# EAGLE design bristol_longshot (EAGLE 7.3.0)
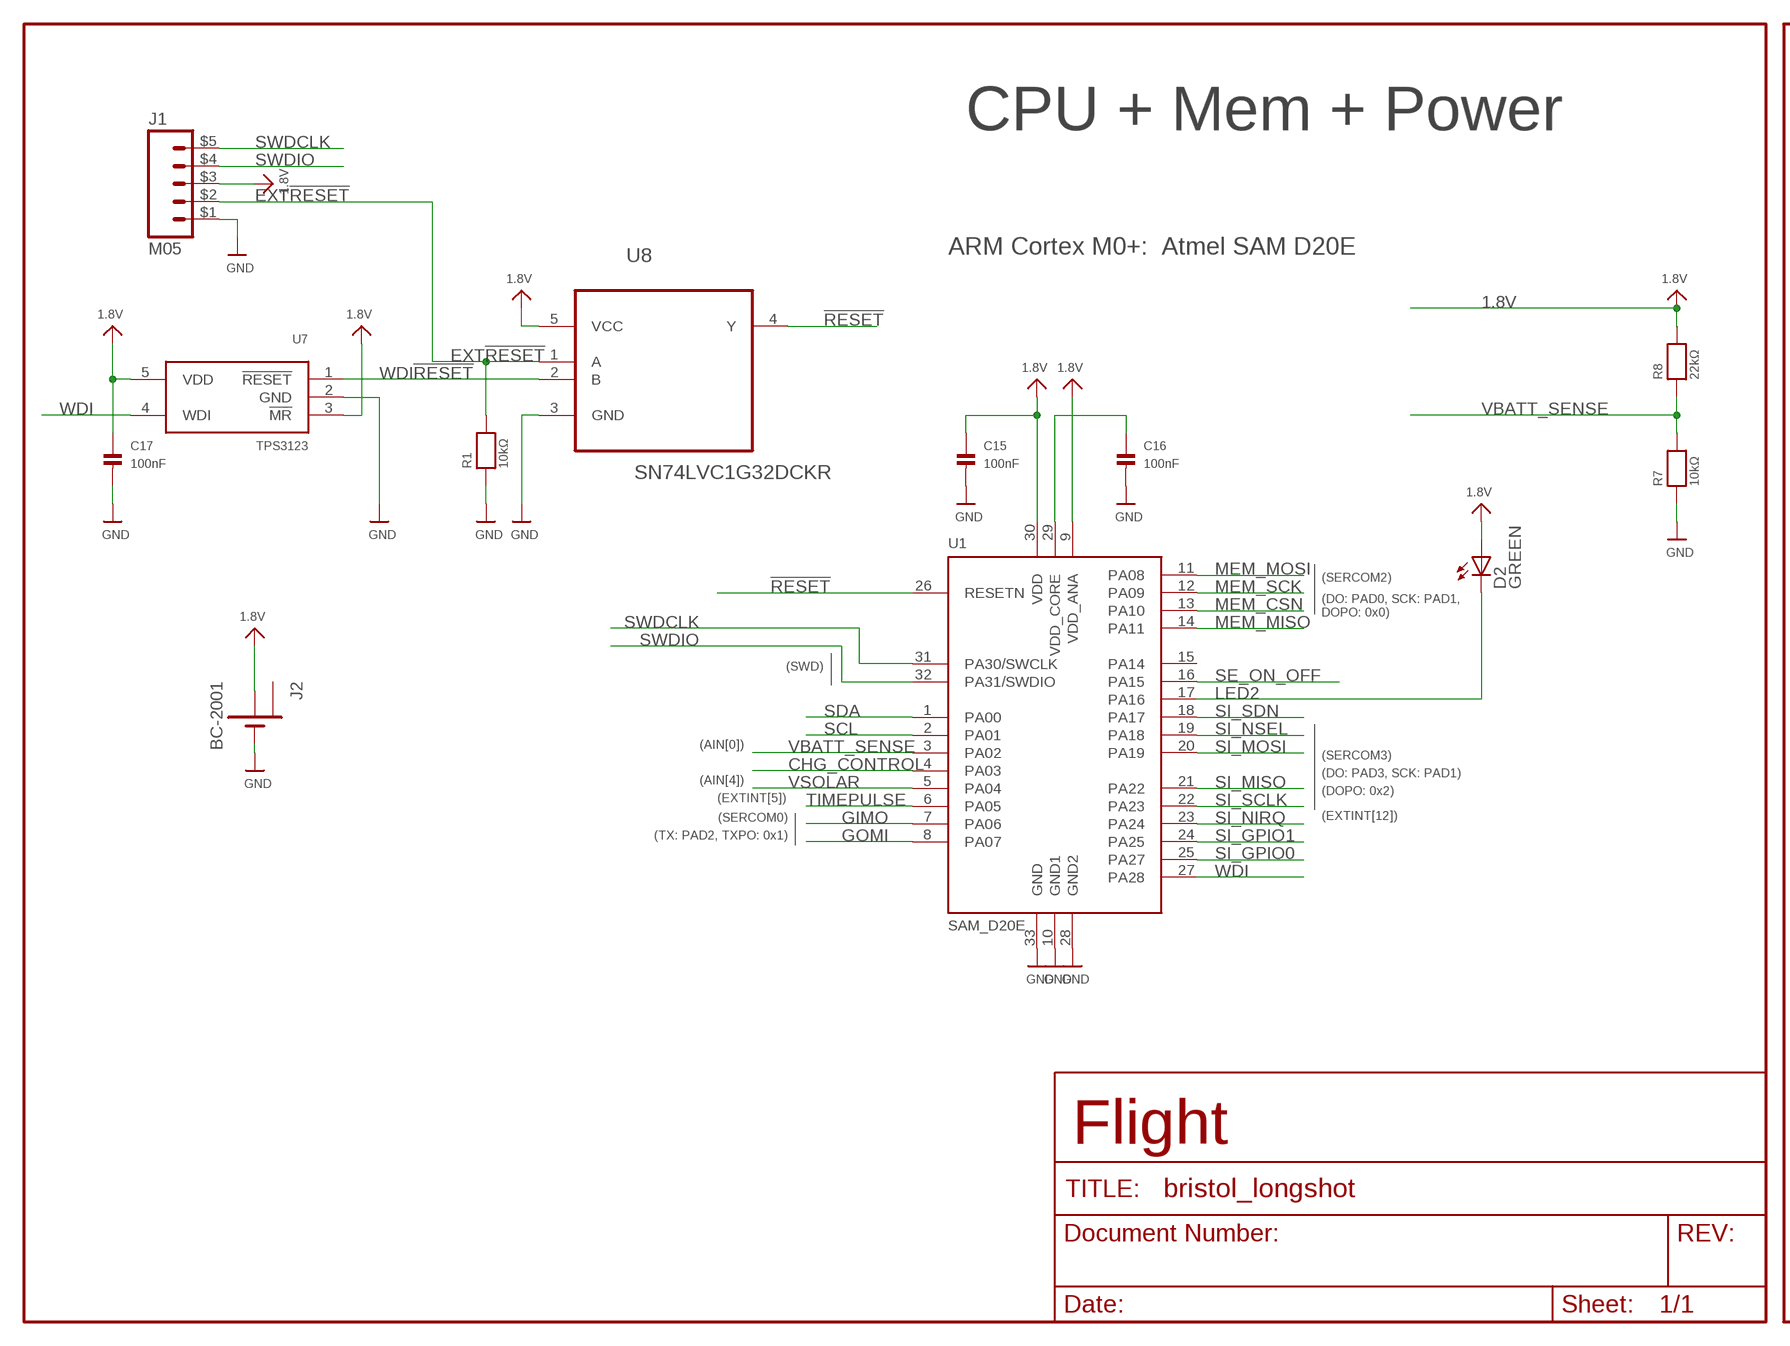
[diagram p0: schematic, sheet 1, part 1 of 2]
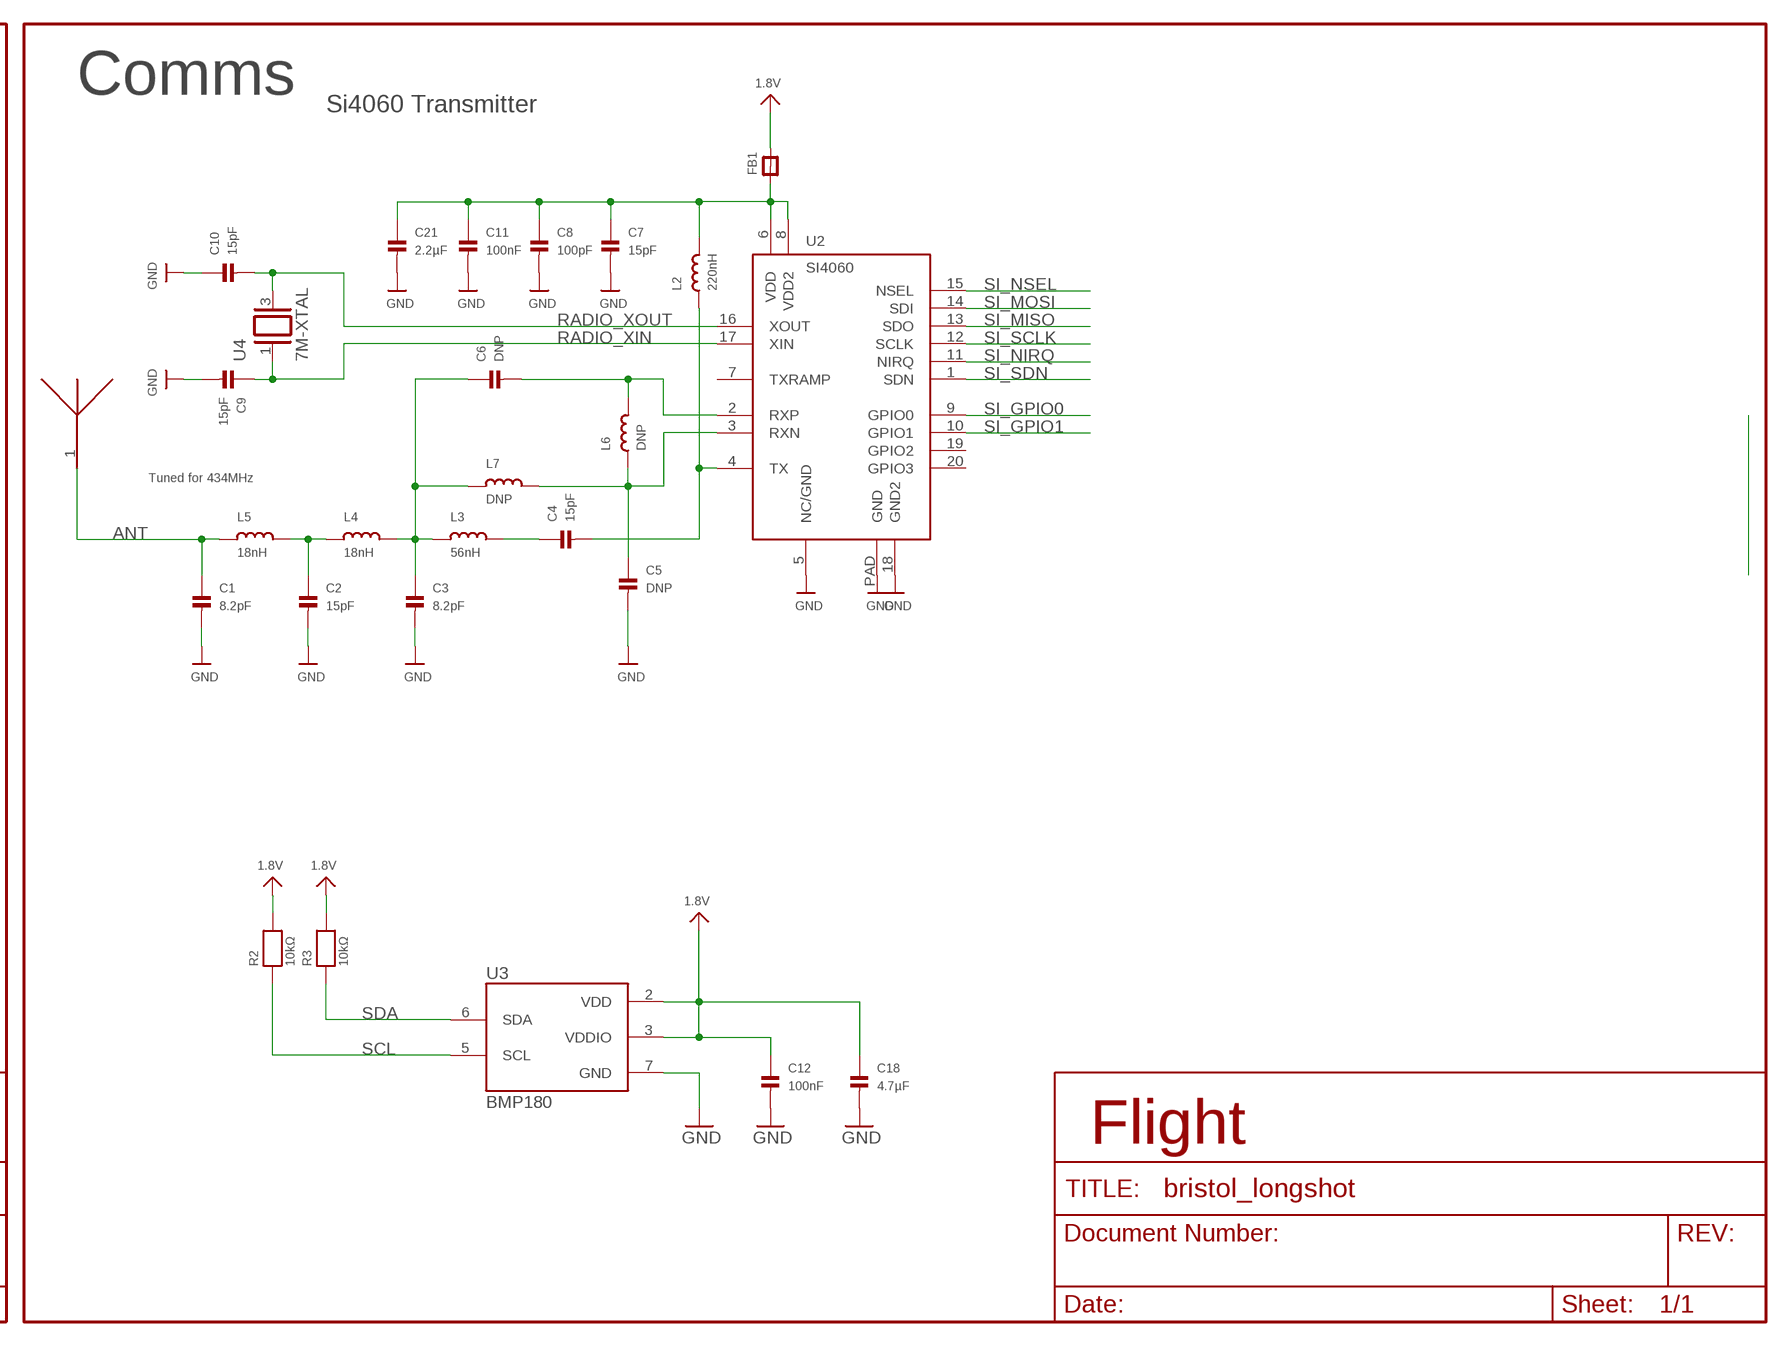
[diagram p1: schematic, sheet 1, part 2 of 2]

## Parts
C1  8.2pF  CAP_CERAMIC_0402  [_0402]
C2  15pF  CAP_CERAMIC_0402  [_0402]
C3  8.2pF  CAP_CERAMIC_0402  [_0402]
C4  15pF  CAP_CERAMIC_0402  [_0402]
C5  DNP  CAP_CERAMIC_0402  [_0402]
C6  DNP  CAP_CERAMIC_0402  [_0402]
C7  15pF  CAP_CERAMIC_0402  [_0402]
C8  100pF  CAP_CERAMIC_0402  [_0402]
C9  15pF  CAP_CERAMIC_0402  [_0402]
C10  15pF  CAP_CERAMIC_0402  [_0402]
C11  100nF  CAP_CERAMIC_0402  [_0402]
C12  100nF  CAP_CERAMIC_0402  [_0402]
C15  100nF  CAP_CERAMIC_0402  [_0402]
C16  100nF  CAP_CERAMIC_0402  [_0402]
C17  100nF  CAP_CERAMIC_0402  [_0402]
C18  4.7µF  CAP_CERAMIC_0402  [_0402]
C21  2.2µF  CAP_CERAMIC_0402  [_0402]
D2  GREEN  LEDCHIPLED_0603  [CHIPLED_0603]
FB1  FERRITE_0402  [_0402]
J1  M05  [M05_SIDE]
J2  BC-2001  [BC-2001]
L2  220nH  INDUCTOR_0402  [_0402]
L3  56nH  INDUCTOR_0402  [_0402]
L4  18nH  INDUCTOR_0402  [_0402]
L5  18nH  INDUCTOR_0402  [_0402]
L6  DNP  INDUCTOR_0402  [_0402]
L7  DNP  INDUCTOR_0402  [_0402]
R1  10kΩ  RESISTOR_0402  [_0402]
R2  10kΩ  RESISTOR_0402  [_0402]
R3  10kΩ  RESISTOR_0402  [_0402]
R7  10kΩ  RESISTOR_0402  [_0402]
R8  22kΩ  RESISTOR_0402  [_0402]
U1  SAM_D20E  [QFN32_5MM]
U2  SI4060  [QFN20]
U3  BMP180  [BMP180]
U4  7M-XTAL  [7M-XTAL]
U5  0433AT62A0020E  [0433AT62A0020E]
U7  TPS3123  [SOT23-5]
U8  SN74LVC1G32DCKR  [SOT65P210X110-5N]

## Nets
1.8V: C12.1 C15.1 C17.1 C18.1 D2.A FB1.2 J1.$3 J2.+VE1(+) R2.2 R3.2 R8.2 U1.9(VDD_ANA) U1.30(VDD) U3.2(VDD) U3.3(VDDIO) U7.3(!MR) U7.5(VDD) U8.5(VCC)
!RESET: U1.26(RESETN) U8.4(Y)
ANT: C1.1 L5.1 U5.1
CHG_CONTROL: U1.4(PA03)
EXT!RESET: J1.$2 R1.2 U8.1(A)
FILTER1: C3.1 C6.1 L3.1 L4.2 L7.1
FILTER2: C2.1 L4.1 L5.2
GIMO: U1.7(PA06)
GND: C1.2 C2.2 C3.2 C5.2 C7.2 C8.2 C9.2 C10.1 C11.2 C12.2 C15.2 C16.2 C17.2 C18.2 C21.2 J1.$1 J2.-VE(-) R1.1 R7.1 U1.10(GND1) U1.28(GND2) U1.33(GND) U2.5(NC/GND) U2.18(GND2) U2.PAD(GND) U3.7(GND) U7.2(GND) U8.3(GND)
GOMI: U1.8(PA07)
LED2: D2.C U1.17(PA16)
MEM_CSN: U1.13(PA10)
MEM_MISO: U1.14(PA11)
MEM_MOSI: U1.11(PA08)
MEM_SCK: U1.12(PA09)
RADIO_VDD: C7.1 C8.1 C11.1 C21.1 FB1.1 L2.2 U2.6(VDD) U2.8(VDD2)
RADIO_XIN: C9.1 U2.17(XIN) U4.1
RADIO_XOUT: C10.2 U2.16(XOUT) U4.3
RF_OUT: C4.2 L2.1 U2.4(TX)
RF_TANK: C4.1 L3.2
RXN: C5.1 L6.1 L7.2 U2.3(RXN)
RXP: C6.2 L6.2 U2.2(RXP)
SCL: R2.1 U1.2(PA01) U3.5(SCL)
SDA: R3.1 U1.1(PA00) U3.6(SDA)
SE_ON_OFF: U1.16(PA15)
SI_GPIO0: U1.25(PA27) U2.9(GPIO0)
SI_GPIO1: U1.24(PA25) U2.10(GPIO1)
SI_MISO: U1.21(PA22) U2.13(SDO)
SI_MOSI: U1.20(PA19) U2.14(SDI)
SI_NIRQ: U1.23(PA24) U2.11(NIRQ)
SI_NSEL: U1.19(PA18) U2.15(NSEL)
SI_SCLK: U1.22(PA23) U2.12(SCLK)
SI_SDN: U1.18(PA17) U2.1(SDN)
SWDCLK: J1.$5 U1.31(PA30/SWCLK)
SWDIO: J1.$4 U1.32(PA31/SWDIO)
TIMEPULSE: U1.6(PA05)
VBATT_SENSE: R7.2 R8.1 U1.3(PA02)
VDD_CORE: C16.1 U1.29(VDD_CORE)
VSOLAR: U1.5(PA04)
WDI: U1.27(PA28) U7.4(WDI)
WDI!RESET: U7.1(!RESET) U8.2(B)
Unconnected: U1.15(PA14) U2.7(TXRAMP) U2.19(GPIO2) U2.20(GPIO3)

## Notes on the sheet
- Comms
- Si4060 Transmitter
- CPU + Mem + Power
- ARM Cortex M0+:  Atmel SAM D20E
- Tuned for 434MHz
- (SERCOM2)
- (DO: PAD0, SCK: PAD1,
  DOPO: 0x0)
- (SWD)
- (AIN[0])
- (SERCOM3)
- (DO: PAD3, SCK: PAD1)
- (AIN[4])
- (DOPO: 0x2)
- (EXTINT[5])
- (SERCOM0) | (EXTINT[12])
- (TX: PAD2, TXPO: 0x1)
- Flight | Flight

## Power pins joined to a net without a drawn wire
+2: J2.+VE2(+2)

## Library data of the parts
C1-C12 C15-C18 C21 = microbuilder_v3:CAP_CERAMIC: Ceramic Capacitors 0402 - 0402 Surface Mount Capacitors 16pF 50V 5% [Digikey: 445-4899-2-ND] 18pF 50V 5% [Digikey: 490-1281-2-ND] 22pF 50V 5% [Digikey: 490-1283-2-ND] 68pF 50V 5% [Digikey: 490-1289-2-ND] 0.1uF 10V 10% [Digikey: 490-1318-2-ND] 1.0uF 6.3V 10% [Digikey: 490-1320-2-ND] 0603 - 0603 Surface Mount Capacitors 16 pF 50V 5% [Digikey: 445-5051-2-ND] 22 pF 50V [Digikey: PCC220ACVTR-ND] 33 pF 50V 5% [Digikey: 490-1415-1-ND] 56pF 50V 5% [Digikey: 490-1421-1-ND] 220pF 50V 5% [Digikey: 445-1285-1-ND] 680 pF 50V 2200 pF 50V 5% C0G [Digikey: 445-1297-1-ND] 5600 pF 100V 5% X7R [Digikey: 478-3711-1-ND] 0.1 µF 25V 10% [Digikey: PCC2277TR-ND] 0.22 µF 16V 10% X7R [Digikey: 445-1318-1-ND] 1.0 µF 25V 10% [Digikey: 445-5146-2-ND] 0603 - RF Specific 3pF 250V +/-0.1pF RF [Digikey: 712-1347-1-ND] 18 pF 250V 5% [Digikey: 478-3505-1-ND or 712-1322-1-ND] 56 pF 250V 5% C0G RF [Digikey: 490-4867-1-ND] 68 pF 250V RF [Digikey: 490-4868-1-ND] 0805 - 0805 Surface Mount Capacitors 220 pF 250V 2% RF Ceramic Capacitor [Digikey: 712-1398-1-ND] 1000 pF 50V 2% NP0 Ceramic Capacitor [Digikey: 478-3760-1-ND] 0.1 µF 25V 10% Ceramic Capacitor [Digikey: PCC1828TR-ND] 1.0 µF 16V 10% Ceramic Capacitor[Digikey: 490-1691-2-ND] 10.0 µF 10V 10% Ceramic Capacitor[Digikey: 709-1228-1-ND] 10.0 uF 16V 10% Ceramic Capacitor [Digikey: 478-5165-2-ND] 47 uF 6.3V 20% Ceramic Capacitor [Digikey: 587-1779-1-ND or 399-5506-1-ND] 1206 - 1206 Surface Mount Capacitors 47uF 10V 20% Ceramic Capacitor [Digikey: 490-5528-1-ND or 399-5508-1-ND or 445-6010-1-ND] 100uF 6.3V -20%, +80% Y5V Ceramic Capacitor (Digikey: 490-4512-1-ND, Mouser: 81-GRM31CF50J107ZE1L)
D2 = led:LED: LED OSRAM: - CHIPLED LG R971, LG N971, LY N971, LG Q971, LY Q971, LO R971, LY R971 LH N974, LH R974 LS Q976, LO Q976, LY Q976 LO Q996 - Hyper CHIPLED LW Q18S LB Q993, LB Q99A, LB R99A - SideLED LS A670, LO A670, LY A670, LG A670, LP A670 LB A673, LV A673, LT A673, LW A673 LH A674 LY A675 LS A676, LA A676, LO A676, LY A676, LW A676 LS A679, LY A679, LG A679 - Hyper Micro SIDELED® LS Y876, LA Y876, LO Y876, LY Y876 LT Y87S - SmartLED LW L88C, LW L88S LB L89C, LB L89S, LG L890 LS L89K, LO L89K, LY L89K LS L896, LA L896, LO L896, LY L896 - TOPLED LS T670, LO T670, LY T670, LG T670, LP T670 LSG T670, LSP T670, LSY T670, LOP T670, LYG T670 LG T671, LOG T671, LSG T671 LB T673, LV T673, LT T673, LW T673 LH T674 LS T676, LA T676, LO T676, LY T676, LB T676, LH T676, LSB T676, LW T676 LB T67C, LV T67C, LT T67C, LS T67K, LO T67K, LY T67K, LW E67C LS E67B, LA E67B, LO E67B, LY E67B, LB E67C, LV E67C, LT E67C LW T67C LS T679, LY T679, LG T679 LS T770, LO T770, LY T770, LG T770, LP T770 LB T773, LV T773, LT T773, LW T773 LH T774 LS E675, LA E675, LY E675, LS T675 LS T776, LA T776, LO T776, LY T776, LB T776 LHGB T686 LT T68C, LB T68C - Hyper Mini TOPLED® LB M676 - Mini TOPLED Santana® LG M470 LS M47K, LO M47K, LY M47K Source: http://www.osram.convergy.de LUXEON: - LUMILED® LXK2-PW12-R00, LXK2-PW12-S00, LXK2-PW14-U00, LXK2-PW14-V00 LXK2-PM12-R00, LXK2-PM12-S00, LXK2-PM14-U00 LXK2-PE12-Q00, LXK2-PE12-R00, LXK2-PE12-S00, LXK2-PE14-T00, LXK2-PE14-U00 LXK2-PB12-K00, LXK2-PB12-L00, LXK2-PB12-M00, LXK2-PB14-N00, LXK2-PB14-P00, LXK2-PB14-Q00 LXK2-PR12-L00, LXK2-PR12-M00, LXK2-PR14-Q00, LXK2-PR14-R00 LXK2-PD12-Q00, LXK2-PD12-R00, LXK2-PD12-S00 LXK2-PH12-R00, LXK2-PH12-S00 LXK2-PL12-P00, LXK2-PL12-Q00, LXK2-PL12-R00 Source: www.luxeon.com KINGBRIGHT: KA-3528ASYC Source: www.kingbright.com
FB1 = microbuilder_v3:FERRITE: Ferrite Bead 0603 MMZ1608B121C - 120 Ohm @ 100MHz, 600mA, 0.15 Ohm DC Resistance - Digikey: 445-2164-1-ND BK1608HW121-T - 120 Ohm, 600mA Ferrite Chip - Digikey: 587-1876-2-ND 0805 HZ0805B272R-10 - 2.7K Ohm @ 100MHz, 200mA, 0.8 Ohm DC Resistance - Digikey: 240-2504-1-ND (see also Murata BLM21BD272SN1L) MMZ2012Y152B - 1.5K Ohm @ 100MHz, 500mA, 0.4 Ohm DC Resistance - Digikey: 445-1560-1-ND - Mainly for high frequency (80-400MHz) MMZ2012R102A - 1K Ohm @ 100MHz, 500mA, 0.3 Ohm DC Resistance - Digikey: 445-1555-2-ND - More general purpose (10-200MHz)
J1 = fbri:M05
J2 = fbri:BC-2001
L2-L7 = microbuilder_v3:INDUCTOR: Inductors 0603: 10nH Ceramic Inductor - microwire antenna/RF (Digikey: 712-1434-2-ND) 0805: 560nH Ceramic Inductor - RF (Digikey: 553-1047-1-ND) 270nH Ceramic Inductor - Q = 40@250MHz, +-5%, 1 Ohm DC Resistance (Digikey: 535-10506-2-ND) 1007 (2518 Metric) SMT: 10µH 10% 250mOhm 820mA 1007 Inductor (Digikey: 587-2189-1-ND) 22µH 10% 500mOhm 580mA 1007 Inductor (Digikey: 587-2190-1-ND) 47µH 10% 950mOhm 420mA 1007 Inductor (Digikey: 587-2191-1-ND) 47µH 5% 100mOhm 1A 1008 Inductor (Digikey: 732-1816-1-ND) 5.0x5.0mm (Taiyo Yuden NR5040 Series) 6.8µH 20% 2.3A 64mOhm Inductor (Digikey: 587-2374-2-ND) 5.0x5.0mm (TDK VLC5045 Series) 4.7µH 20% 3.3A 34mOhm Inductor (Digikey: 445-6526-1-ND) 6.8µH 20% 2.7A 46mOhm Inductor (Digikey: 445-6527-1-ND) 6.0x6.0mm (TDK VLC6045 Series) 4.7µH 20% 3.8A 27mOhm Inductor (Digikey: 445-6538-2-ND) 6.8µH 20% 3A 41mOhm Inductor (Digikey: 445-6540-1-ND) 6.2µH 30% 2.2A 45mOhm Inductor (Digikey: SRR5028-6R2YCT-ND) - Not TDK VLC6045 but footprint should match 6.0x6.0mm (TDK SLF6045 Series) 6.8uH 30% 2A 33mOhm Inductor (Digikey: 445-4572-1-ND, Mouser: 810-SLF645T6R8N2R0PF)
R1-R3 R7 R8 = microbuilder_v3:RESISTOR: Resistors 0402 - 0402 Surface Mount Package 22 Ohm 1% 1/16W [Digikey: 311-22.0LRTR-ND] 33 Ohm 5% 1/16W 1.0K 5% 1/16W 1.5K 5% 1/16W 2.0K 1% 1/16W 10.0K 1% 1/16W [Digikey: 311-10.0KLRTR-ND] 10.0K 5% 1/16W [Digikey: RMCF0402JT10K0TR-ND] 12.1K 1% 1/16W [Digikey: 311-22.0LRTR-ND] 100.0K 5% 1/16W 0603 - 0603 Surface Mount Package 0 Ohm 1/10 Watt 1% Resistor 15 Ohm 1/10 Watt 1% Resistor 33 Ohm 1/10 Watt 1% Resistor 49.9 Ohm 1/10 Watt 1% Resistor 100 Ohm 1/10 Watt 1% Resistor 150 Ohm 1/10 Watt 1% Resistor 240 Ohm 1/10 Watt 1% Resistor 390 Ohm 1/10 Watt 1% Resistor 560 Ohm 1/10 Watt 1% Resistor 680 Ohm 1/10 Watt 1% Resistor 750 Ohm 1/10 Watt 1% Resistor 1.0K Ohm 1/10 Watt 1% Resistor 1.5K Ohm 1/10 Watt 1% Resistor 2.0K Ohm 1/10 Watt 1% Resistor 2.2K Ohm 1/10 Watt 1% Resistor 3.3K Ohm 1/10 Watt 1% Resistor 4.7K Ohm 1/10 Watt 1% Resistor 10.0K Ohm 1/10 Watt 1% Resistor 12.0K Ohm 1/10 Watt 1% Resistor 12.1K Ohm 1/10 Watt 1% Resistor 20.0K Ohm 1/10 Watt 1% Resistor 33.0K Ohm 1/10 Watt 1% Resistor 100.0K Ohm 1/10 Watt 1% Resistor 0805 - 0805 Surface Mount Package 0 Ohm 1/8 Watt 1% Resistor 33 Ohm 1/8 Watt 1% Resistor 100 Ohm 1/8 Watt 1% Resistor 150 Ohm 1/8 Watt 1% Resistor 200 Ohm 1/8 Watt 1% Resistor 240 Ohm 1/8 Watt 1% Resistor 330 Ohm 1/8 Watt 1% Resistor 390 Ohm 1/8 Watt 1% Resistor 470 Ohm 1/8 Watt 1% Resistor 1.0K Ohm 1/8 Watt 1% Resistor 1.5K Ohm 1/8 Watt 1% Resistor 2.0K Ohm 1/8 Watt 1% Resistor 4.7K Ohm 1/8 Watt 1% Resistor 5.1K Ohm 1/8 Watt 1% Resistor 5.6K Ohm 1/8 Watt 1% Resistor 10.0K Ohm 1/8 Watt 1% Resistor 22.0K Ohm 1/8 Watt 1% Resistor 33.0K Ohm 1/8 Watt 1% Resistor 100K Ohm 1/8 Watt 1% Resistor 1206 - 1206 Surface Mount Package 2012 - 2010 Surface Mount Package 0.11 Ohm 1/2 Watt 1% Resistor - Digikey: RHM.11UCT-ND
U1 = fbri:SAM_D20E
U2 = fbri:SI4060
U3 = SparkFun-Sensors:BMP180: BOSCH BMP180 DIGITAL BAROMETRIC PRESSURE SENSOR Web page: http://www.bosch-sensortec.com/en/homepage/products_3/environmental_sensors_1/bmp180_1/bmp180 Datasheet: http://ae-bst.resource.bosch.com/media/products/dokumente/bmp180/BST-BMP180-DS000-09.pdf The BMP180 is the function compatible successor of the BMP085, a new generation of high precision digital pressure sensors for consumer applications. The ultra-low power, low voltage electronics of the BMP180 is optimized for use in mobile phones, PDAs, GPS navigation devices and outdoor equipment. With a low altitude noise of merely 0.25m at fast conversion time, the BMP180 offers superior performance. The I2C interface allows for easy system integration with a microcontroller. The BMP180 is based on piezo-resistive technology for EMC robustness, high accuracy and linearity as well as long term stability. Key features: - Temperature measurement included - I2C interface - Fully calibrated - Pb-free, halogen-free and RoHS compliant, - MSL 1 Basic specs: Pressure range: 300 to 1100hPa (+9000m to -500m relating to sea level) Supply voltage: 1.8 to 3.6V (VDD), 1.62V to 3.6V (VDDIO) Package: LGA package with metal lid Small footprint: 3.6mm x 3.8mm Super-flat: 0.93mm height Low power: 5μA at 1 sample / sec. in standard mode Low noise: 0.06hPa (0.5m) in ultra low power mode, 0.02hPa (0.17m) advanced resolution mode Typical applications: - Enhancement of GPS navigation (dead-reckoning, slope detection, etc.) - In- and out-door navigation - Leisure and sports - Weather forecast - Vertical velocity indication (rise/sink speed)
U4 = fbri:7M-XTAL
U5 = fbri:0433AT62A0020E
U7 = TPS3125:TPS3123
U8 = SN74LVC1G32DCKR:SN74LVC1G32DCKR: 2-INPUT POSITIVE-OR GATE; MPN: SN74LVC1G32DCKR; OC_FARNELL: 1470880; OC_NEWARK: 76C4094; PACKAGE: SC-70-5; SUPPLIER: Texas Instruments

## Board
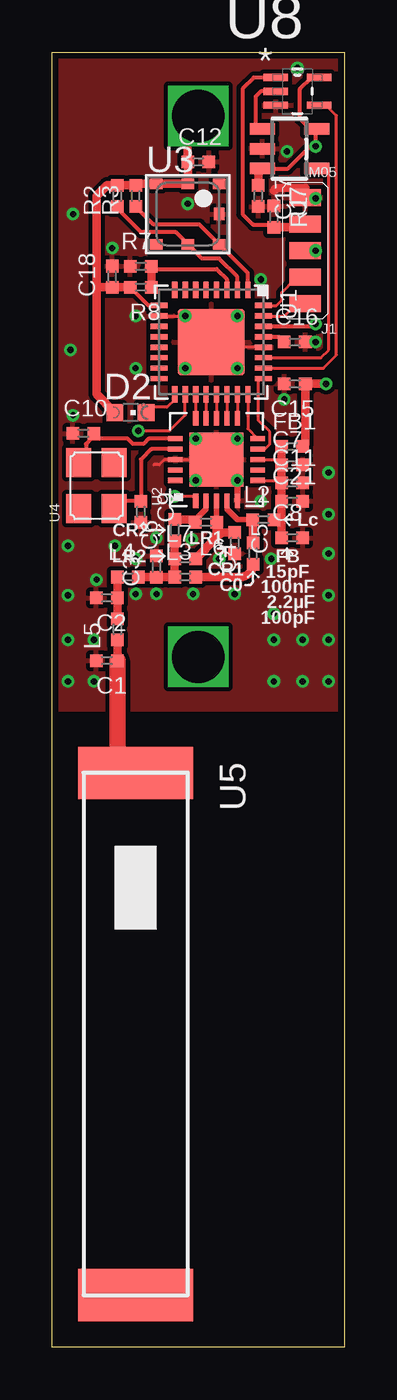
[diagram p2: board, top side]
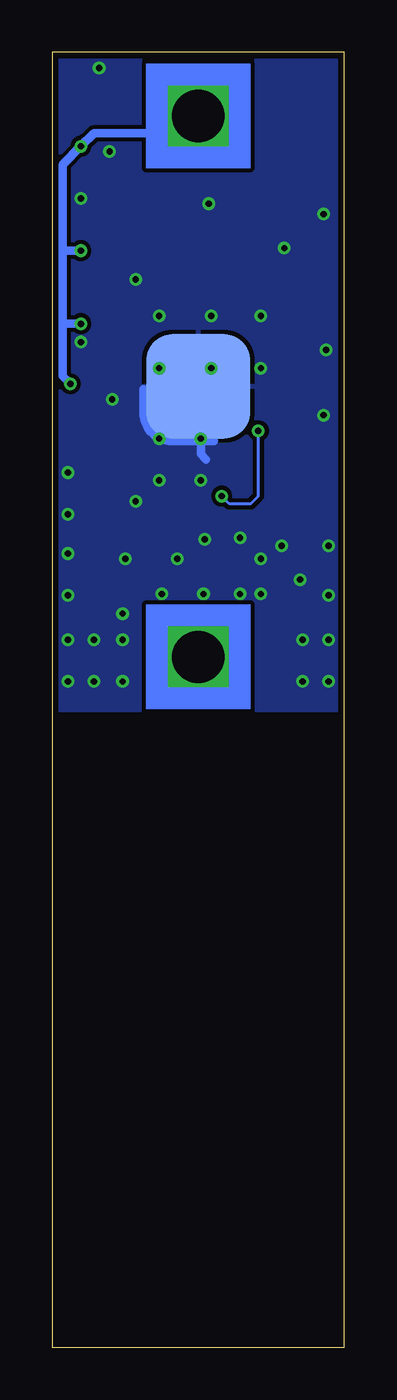
[diagram p3: board, bottom side, seen from below]

Size 14 x 62 mm. Coordinates in mm from the lower left corner, seen from the top.
Outline: 0,0 0,62 14,62 14,0 0,0
Copper layers (1*16): Top 0.035mm / dielectric 1.5mm / Bottom 0.035mm
Design rules "PCB-POOL Standard *": minimum track width 0.15mm, minimum drill 0.3mm, track to track 0.15mm, track to pad 0.15mm, pad to pad 0.15mm, via to via 0.15mm, smd to smd 0.15mm, copper to edge 0.3mm, drill to drill 0.2mm, minimum pad ring 0.2mm, minimum via ring 0.15mm, stop-mask expansion 0.075mm, vias tented up to drill 0.3mm, thermal gap 0.2mm
tRestrict: area 6.3,40.1 to 6.5,40.4

### Footprints (pad centres in the part's own frame; a part is rotated, then mirrored left to right if it is on the bottom)
_0402 = smd 0.6 x 0.6: 1 -0.508,0; 2 0.508,0
CHIPLED_0603 = smd 0.8 x 0.8: A 0,-0.75; C 0,0.75
M05_SIDE = smd 1.5 x 0.8: $1 0,-2.54; $2 0,-1.27; $3 0,0; $4 0,1.27; $5 0,2.54
BC-2001 = drill 2.5 square: +VE1 -12.95,0; +VE2 12.95,0 | smd 5 x 5: -VE 0,0
QFN32_5MM = smd 0.8 x 0.25: 1 -2.5,1.75; 2 -2.5,1.25; 3 -2.5,0.75; 4 -2.5,0.25; 5 -2.5,-0.25; 6 -2.5,-0.75; 7 -2.5,-1.25; 8 -2.5,-1.75; 17 2.5,-1.75; 18 2.5,-1.25; 19 2.5,-0.75; 20 2.5,-0.25; 21 2.5,0.25; 22 2.5,0.75; 23 2.5,1.25; 24 2.5,1.75 | smd 0.25 x 0.8: 9 -1.75,-2.5; 10 -1.25,-2.5; 11 -0.75,-2.5; 12 -0.25,-2.5; 13 0.25,-2.5; 14 0.75,-2.5; 15 1.25,-2.5; 16 1.75,-2.5; 25 1.75,2.5; 26 1.25,2.5; 27 0.75,2.5; 28 0.25,2.5; 29 -0.25,2.5; 30 -0.75,2.5; 31 -1.25,2.5; 32 -1.75,2.5 | smd 3.2 x 3.2: 33 0,0
QFN20 = smd 0.7 x 0.25: 1 -1.97,1; 2 -1.97,0.5; 3 -1.97,0; 4 -1.97,-0.5; 5 -1.97,-1; 11 1.97,-1; 12 1.97,-0.5; 13 1.97,0; 14 1.97,0.5; 15 1.97,1 | smd 0.25 x 0.7: 6 -1,-1.97; 7 -0.5,-1.97; 8 0,-1.97; 9 0.5,-1.97; 10 1,-1.97; 16 1,1.97; 17 0.5,1.97; 18 0,1.97; 19 -0.5,1.97; 20 -1,1.97 | smd 2.6 x 2.6: PAD 0,0
BMP180 = smd 0.6 x 0.5: 1 1.5,1.45; 2 0,1.45; 3 -1.5,1.45; 4 -1.5,-1.45; 5 0,-1.45; 6 1.5,-1.45 | smd 0.5 x 0.6: 7 1.5,0
7M-XTAL = smd 1.4 x 1.2: 1 -1.1,-0.85; 2 1.1,-0.85; 3 1.1,0.85; 4 -1.1,0.85
0433AT62A0020E = smd 5.5 x 2.5: 1 0,-12.5; 2 0,12.5
SOT23-5 = smd 0.55 x 1.2: 1 -0.95,-1.3; 2 0,-1.3; 3 0.95,-1.3; 4 0.95,1.3; 5 -0.95,1.3
SOT65P210X110-5N = smd 1.168 x 0.356: 1 -1.041,0.66; 2 -1.041,0; 3 -1.041,-0.66; 4 1.041,-0.66; 5 1.041,0.66

### Placement (x,y rotation side)
C1  2.62,32.88 180 top
C2  2.62,35.88 180 top
C3  5,37.38 90 top
C4  9.62,38 90 top
C5  8.75,38.5 270 top
C6  5.88,39.12 90 top
C7  11.5,42.25 0 top
C8  11.5,38.75 0 top
C9  4.25,40 270 top
C10  1.5,43.75 0 top
C11  11.5,41.38 0 top
C12  7,56.75 0 top
C15  11.62,46.12 180 top
C16  11.62,48.12 0 top
C17  9.88,55.12 270 top
C18  2.88,51.25 90 top
C21  11.5,40.5 0 top
D2  3.75,44.75 270 top
FB1  11.5,43.12 0 top
J1  12.12,52.5 180 top
J2  7,46 270 bottom
L2  10.12,39.62 0 top
L3  6.38,36.88 0 top
L4  3.62,36.88 0 top
L5  3.12,34.38 90 top
L6  7.38,39.5 180 top
L7  6.38,37.75 0 top
R1  10.62,54.12 270 top
R2  3.12,55.12 90 top
R3  4,55.12 90 top
R7  4.25,51.75 0 top
R8  4.25,50.75 180 top
U1  7.62,48.12 270 top
U2  7.88,42.5 90 top
U3  6.5,54.25 0 top
U4  2.12,41.25 90 top
U5  4,15 180 top
U7  11.38,57.38 270 top
U8  11.75,60.12 0 top

### Tracks (layer width: path | path; a pad name or v marks a point on that pad's centre or on a via)
1.8V  (via drill 0.3)
  Top 0.2: U1.30 12.5,48.88 v12.62,49 | U8.5 12.41,60.78 11.88,60.25 11.88,58.83 12.38,58.33 U7.5 12.62,58.27 v12.62,57.5 12.38,57.5 11.3,56.42 U7.3 | U1.9 4.62,49.88 R8.2
  Top 0.4: v13.12,46.12 C15.1 12.13,43.25 FB1.2 | U7.3 9.88,56.23 C17.1 | J2.+VE1 6.49,58.44 C12.1 U3.2 U3.3 4.07,55.7 R3.2 R2.2 2.63,55.63 2.12,55.12 2.12,50.75 | R8.2 3.48,50.74 C18.1 2.13,50.74 2.12,50.75 | 2.12,50.75 2.12,45.62 D2.A
  Top 0.406: J1.$3 v12.62,52.5
  Bottom 0.4: v12.62,49 13.5,49 | 13.5,49 13.5,46.5 v13.12,46.12 | v12.62,52.5 13.5,52.5 | 13.5,52.5 13.5,49 | 13.5,52.5 13.5,56.62 v12.62,57.5 12,58.12 7.83,58.12 J2.+VE1
!RESET
  Top 0.15: U1.26 13,46.88 13.62,47.5 13.62,58.97 13.12,59.47 U8.4 13.16,59.47 13.25,59.38
ANT
  Top 0.4: L5.1 3.13,33.86 C1.1
  Top 0.8: C1.1 3.13,28.37 U5.1
EXT!RESET
  Top 0.2: U8.1 9.66,60.78 9.12,60.25 9.12,54.25 9.62,53.75 10.49,53.75 R1.2
  Top 0.4: J1.$2 11.97,53.62 R1.2
FILTER1
  Top 0.4: L4.2 L3.1 5.86,36.87 C3.1
  Top 0.406: C6.1 5.87,38.62 L7.1 L3.1 5.88,37
FILTER2
  Top 0.4: L4.1 3.12,36.87 C2.1 | C2.1 L5.2 | C2.1
GND  (via drill 0.3)
  Top 0.152: U1.10 v6.38,49.38 U1.33 7.62,49.38 v8.88,49.38 | 6.88,42.25 6.62,42.5 U2.18 5.38,42.5 5.12,42.25 4.87,42.25 | U1.28 9,47.88 9,47 v8.88,46.88 | U2.PAD v8.88,43.5
  Top 0.305: 6.88,42.25 v6.88,41.5 | U2.5 v8.88,41.5
  Top 0.4: 10.63,55.38 10.75,55.5 12.13,55.51 | 12.13,55.51 12.12,55 | J1.$1 12.1,55.04 12.13,55.51 | U1.33 8.75,48.12 9,47.88
  Bottom 0.4: v6.38,46.88 6.38,46.62 J2.-VE | 6.62,42.5 6.88,42.75 v6.88,43.5 6.62,43.5 6.5,43.38 | 6.25,43.38 6.5,43.38 | 6.5,43.38 8.25,43.38 arc90 9.62,44.75 9.62,45.88
  other vias: 10,40.5 0.75,33.88 13.25,33.88 10.62,33.88 6.69,38.69 0.75,36 0.75,38.38 5,38.75 5,36.06 13.25,36 10.5,37.75 8,37.75 4,36.06 6.75,36.06 10.62,35.12 8.75,36.06 13.25,38 13.25,39.88 4,37.75 1,44.62 3,38.38 2,33.88 12,33.88 13.25,41.88 11.12,45.38 12.62,48.12 11.25,57.25 12.62,55 10,51.12 4,49.38 6.5,54.75 2.12,36.75 0.75,31.88 2,31.88 10.62,31.88 12,31.88 13.25,31.88 2.88,52.62 0.88,47.75 1,54.25 4,46.88 11.75,61.25
  pour Top (isolate 0.2): 0,62 14,62 14,30.5 0,30.5
  pour Bottom (isolate 0.2): 0,62 14,62 14,30.5 0,30.5
LED2
  Top 0.15: U1.17 5.88,45.38 5.5,45 4.62,45
  Top 0.2: 4.62,45 D2.C
RADIO_VDD
  Top 0.152: U2.8 10.87,42.5 C7.1 10.87,41.38 10.88,41.38 10.88,41.49 10.99,41.5 U2.6
  Top 0.406: FB1.1 C7.1 10.99,41.5 C11.1 C21.1 10.99,39.62 | 10.99,39.62 C8.1 | L2.2 10.99,39.62
RADIO_XIN
  Top 0.2: U2.17 4.75,43 4.25,42.5 C9.1 3.33,40.51 U4.1
RADIO_XOUT
  Top 0.2: U2.16 4.62,43.5 4.38,43.25 3.88,43.25 3.62,43.5 2.26,43.5 | 2.26,43.5 C10.2 | 1.65,42.65 U4.3 1.27,42.4 1.62,42.75 1.62,43.25 1.88,43.5 2.26,43.5
RF_OUT
  Top 0.254: U2.4 8.38,40.12 8.88,39.62 L2.1 9.68,39.75
  Top 0.406: L2.1 9.62,39.69 C4.2
RF_TANK
  Top 0.4: L3.2 9.01,36.88 arc90 C4.1
RXN
  Top 0.254: U2.3 L6.1
  Top 0.406: L7.2 7.88,38.76 | 7.88,38.76 L6.1 | 7.88,38.76 8.13,39.01 C5.1
RXP
  Top 0.254: U2.2 7.38,40.13 6.88,39.63 | 6.88,39.63 L6.2 | 6.88,39.63 L6.2
  Top 0.406: C6.2 6.86,39.63 L6.2
SCL
  Top 0.2: U1.2 8.88,51.25 8,52.12 7.17,52.12 U3.5 5.92,53.38 4.25,53.38 3.12,54.5 R2.1
SDA
  Top 0.2: 8.12,52.75 8.18,52.8 U3.6 | U1.1 9.38,51.42 U3.6 | U3.6 7.05,53.75 4.87,53.75 R3.1
SI_GPIO0
  Top 0.15: 10.42,43.83 9.88,44.38 9.88,46.38 U1.25
  Top 0.152: U2.9 10.19,43 10.42,43.24 10.42,43.83 | 10.17,46.33 U1.25
SI_GPIO1
  Top 0.15: U1.24 9.38,43.97 U2.10
  Top 0.152: 9.62,43.5 U2.10
SI_MISO
  Top 0.152: U1.21 U2.13
SI_MOSI
  Top 0.152: U1.20 U2.14
SI_NIRQ
  Top 0.152: U1.23 U2.11
SI_NSEL
  Top 0.152: U1.19 U2.15
SI_SCLK
  Top 0.152: U1.22 U2.12
SI_SDN  (via drill 0.3)
  Top 0.15: v4.12,43.88 5.62,43.88 6.38,44.62 U1.18
  Top 0.152: 6.88,40.72 U2.1 6.88,40.75 v5.88,40.75
  Bottom 0.152: v4.12,43.88 4.12,40.75 4.5,40.38 5.5,40.38 v5.88,40.75
SWDCLK
  Top 0.15: U1.31 11.12,49.38 11.5,49.75 11.91,49.75 J1.$5
SWDIO
  Top 0.15: U1.32 10.75,49.88 11,50.12 11,50.5 11.62,51.12 12.02,51.12 J1.$4
VBATT_SENSE
  Top 0.2: R7.2 4.51,51.63 4.5,51.62 7.88,51.62 8.38,51.12 U1.3
  Top 0.4: R8.1 R7.2
VDD_CORE
  Top 0.2: U1.29 10.88,48.38 11.12,48.13 C16.1
WDI
  Top 0.15: U1.27 12.88,47.38 13.25,47.75 13.25,56.42 U7.4
WDI!RESET
  Top 0.2: U8.2 10,60.12 9.75,59.88 9.75,58.4 U7.1

### Text on the board
tPlace: CR2 | Lc | LR2 | LR1 | CR1 | C0 | FB / 15pF / 100nF / / 100pF | 2.2µF
tStop: BRISTOL | UNIVERSITY | V0.984.0 | ARM / - / SWD
bStop: (C) Richard Meadows 2015